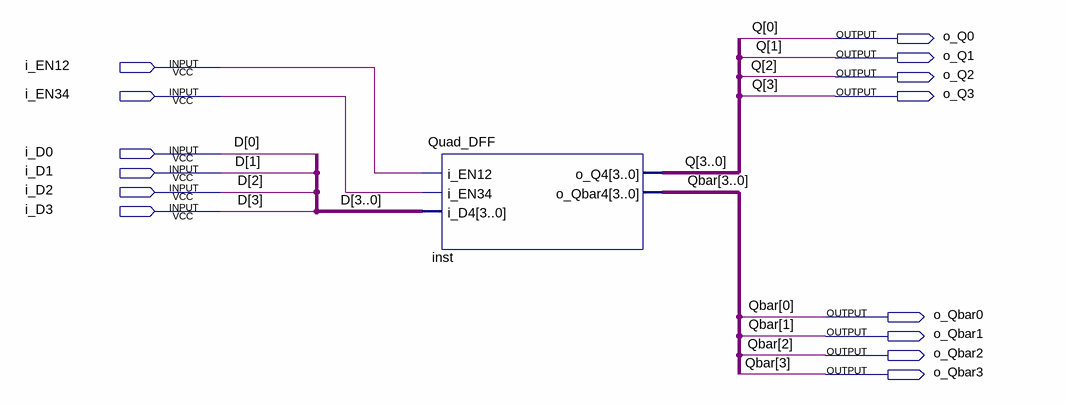
[diagram p0: schematic sheet]
// Quartus schematic DFF_schematic.bdf as structural Verilog: 1 symbols, 14 pins
module DFF_schematic (
  input  i_EN12,
  input  i_EN34,
  input  i_D0,
  input  i_D1,
  input  i_D2,
  input  i_D3,
  output o_Q0,
  output o_Q1,
  output o_Q2,
  output o_Q3,
  output o_Qbar0,
  output o_Qbar1,
  output o_Qbar2,
  output o_Qbar3
);

  Quad_DFF inst (
    .i_EN12(i_EN12), .i_EN34(i_EN34), .i_D4({i_D3, i_D2, i_D1, i_D0}), .o_Q4({o_Q3, o_Q2, o_Q1, o_Q0}),
    .o_Qbar4({o_Qbar3, o_Qbar2, o_Qbar1, o_Qbar0}));

  // Other names for the same wires on the sheet: D[3:0] = {i_D3, i_D2, i_D1, i_D0}; Q[3:0] = {o_Q3, o_Q2, o_Q1, o_Q0};
  //   Qbar[3:0] = {o_Qbar3, o_Qbar2, o_Qbar1, o_Qbar0}
endmodule
